# Altium schematic sheet Sheet1.SchDoc
size A4; SheetNumber: 1; SheetTotal: 1
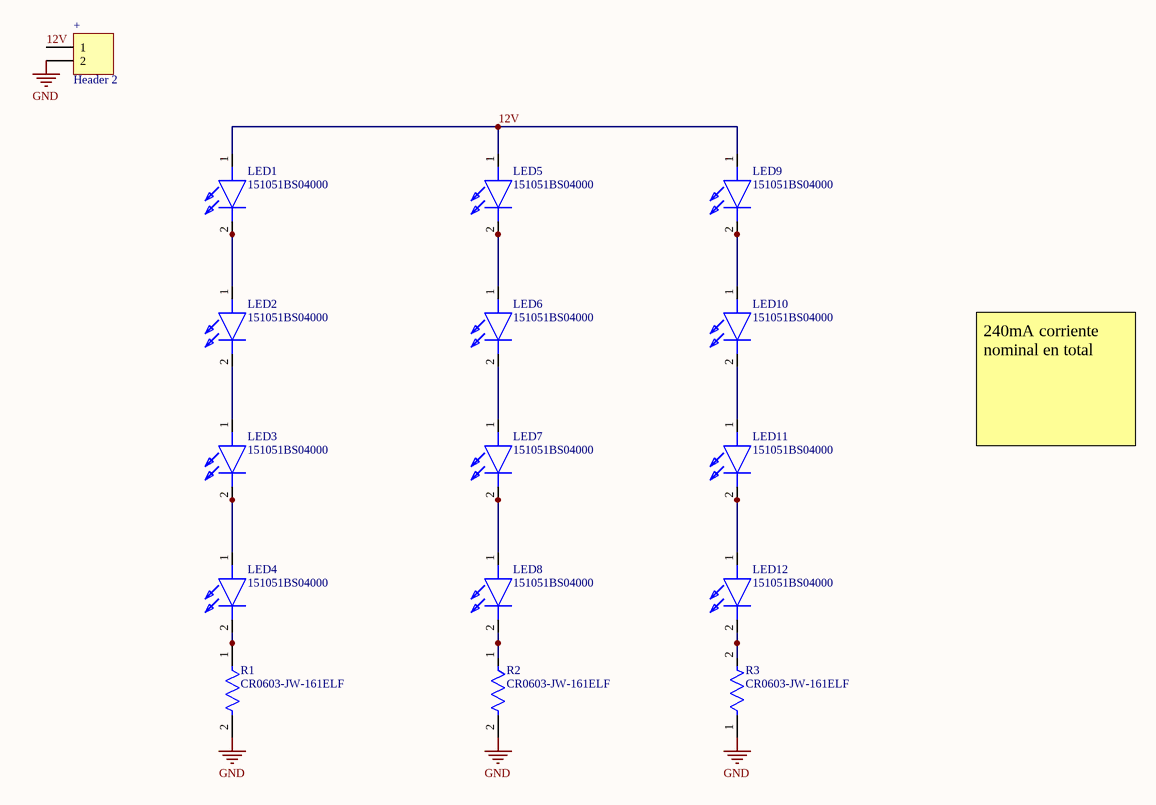
[diagram p0: Sheet1.SchDoc]

## Parts
+  Header 2  [HDR1X2]
LED1  151051BS04000  [151051BS04000]
LED2  151051BS04000  [151051BS04000]
LED3  151051BS04000  [151051BS04000]
LED4  151051BS04000  [151051BS04000]
LED5  151051BS04000  [151051BS04000]
LED6  151051BS04000  [151051BS04000]
LED7  151051BS04000  [151051BS04000]
LED8  151051BS04000  [151051BS04000]
LED9  151051BS04000  [151051BS04000]
LED10  151051BS04000  [151051BS04000]
LED11  151051BS04000  [151051BS04000]
LED12  151051BS04000  [151051BS04000]
R1  CR0603-JW-161ELF  [FP-CR0603-IPC_B]
R2  CR0603-JW-161ELF  [FP-CR0603-IPC_B]
R3  CR0603-JW-161ELF  [FP-CR0603-IPC_B]

## Nets
GND: +.2 R1.2 R2.2 R3.1
12V: +.1 LED1.1(A) LED5.1(A) LED9.1(A)
NetLED1_2: LED1.2(K) LED2.1(A)
NetLED2_2: LED2.2(K) LED3.1(A)
NetLED3_2: LED3.2(K) LED4.1(A)
NetLED4_2: LED4.2(K) R1.1
NetLED5_2: LED5.2(K) LED6.1(A)
NetLED6_2: LED6.2(K) LED7.1(A)
NetLED7_2: LED7.2(K) LED8.1(A)
NetLED8_2: LED8.2(K) R2.1
NetLED9_2: LED9.2(K) LED10.1(A)
NetLED10_2: LED10.2(K) LED11.1(A)
NetLED11_2: LED11.2(K) LED12.1(A)
NetLED12_2: LED12.2(K) R3.2

## Notes on the sheet
- 240mA corriente nominal en total

## Library data of the parts
+ = Header 2: Header, 2-Pin; LatestRevisionDate: 17-Jul-2002; LatestRevisionNote: Re-released for DXP Platform.; Publisher: Altium Limited
LED1-LED12 = 151051BS04000: LED; Manufacturer_Name: Wurth Elektronik; Datasheet Link: https://katalog.we-online.de/led/datasheet/151051BS04000.pdf; Height: 8.95mm; Manufacturer_Part_Number: 151051BS04000; Mouser Part Number: 710-151051BS04000; Mouser Price/Stock: https://www.mouser.co.uk/ProductDetail/Wurth-Elektronik/151051BS04000?qs=LlUlMxKIyB3OjuZOlqaOjg%3D%3D
R1-R3 = CMP-1012-00055-2: Thick Film Chip Resistors 0603 160Ω 0.1W 5% 200ppm/°C; Power Rating: 100mW; Voltage Rating: 50V; Resistance: 160R; Number of Terminations: 2; Case Code (Metric): 1608; Termination: SMD/SMT; Package Quantity: 5000; Width: 0.031inch; Height: 0.022inch; Temperature Coefficient: 200ppm/°C; Max Power Dissipation: 100mW; Packaging: Tape and Reel; Case/Package: 0603; Radiation Hardening: No; Military Standard: Not; Thickness: 457um; Depth: 0.8mm; Min Operating Temperature: -55°C; Composition: Thick Film; Max Operating Temperature: 155°C; Contact Plating: Tin; Features: Moisture Resistant; Length: 1.6mm; Tolerance: 5%; Mount: Surface Mount; Case Code (Imperial): 0603